# EAGLE design acs712_breaker (EAGLE 5.11)
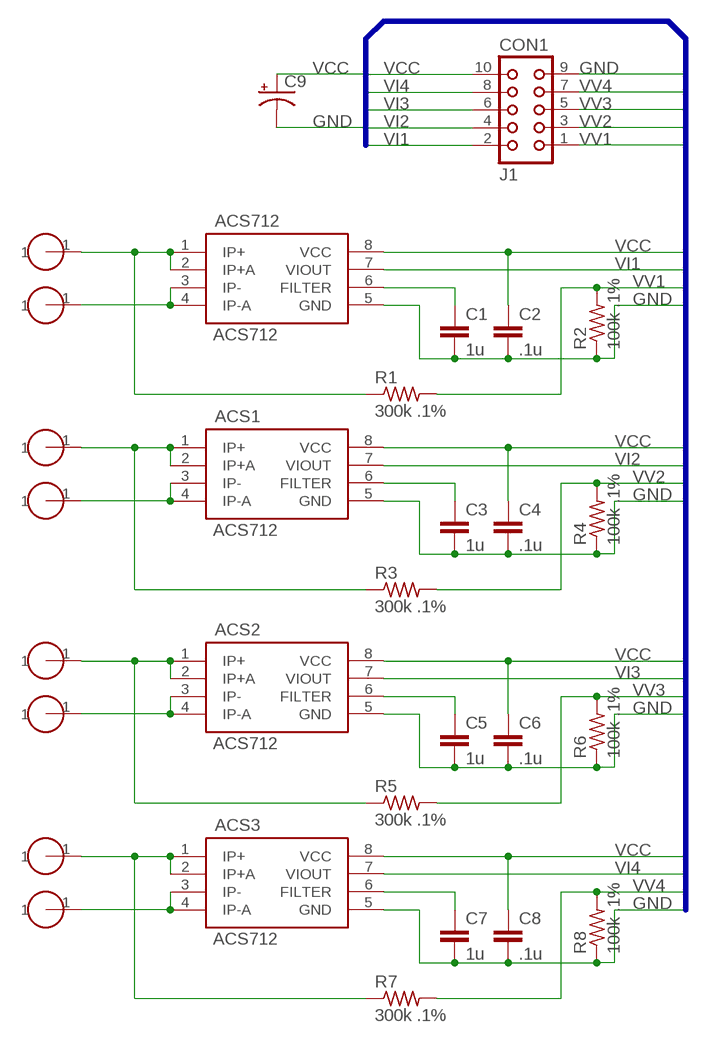
[diagram p0: schematic, sheet 1]

## Parts
ACS1  ACS712  [SOICC]
ACS2  ACS712  [SOICC]
ACS3  ACS712  [SOICC]
ACS712  ACS712  [SOICC]
C1  1u  C-EUC0603  [C0603]
C2  .1u  C-EUC0603  [C0603]
C3  1u  C-EUC0603  [C0603]
C4  .1u  C-EUC0603  [C0603]
C5  1u  C-EUC0603  [C0603]
C6  .1u  C-EUC0603  [C0603]
C7  1u  C-EUC0603  [C0603]
C8  .1u  C-EUC0603  [C0603]
C9  CPOL-USE2.5-6  [E2,5-6]
CON1  J1  CON10  [CON10]
R1  300k .1%  R-US_R0603  [R0603]
R2  100k .1%  R-US_R0603  [R0603]
R3  300k .1%  R-US_R0603  [R0603]
R4  100k .1%  R-US_R0603  [R0603]
R5  300k .1%  R-US_R0603  [R0603]
R6  100k .1%  R-US_R0603  [R0603]
R7  300k .1%  R-US_R0603  [R0603]
R8  100k .1%  R-US_R0603  [R0603]
U$1  LEE_SCREW8  [LEE_SCREW8]
U$2  LEE_SCREW8  [LEE_SCREW8]
U$3  LEE_SCREW8  [LEE_SCREW8]
U$4  LEE_SCREW8  [LEE_SCREW8]
U$5  LEE_SCREW8  [LEE_SCREW8]
U$6  LEE_SCREW8  [LEE_SCREW8]
U$7  LEE_SCREW8  [LEE_SCREW8]
U$8  LEE_SCREW8  [LEE_SCREW8]

## Nets
GND: ACS1.5(GND) ACS2.5(GND) ACS3.5(GND) ACS712.5(GND) C1.2 C2.2 C3.2 C4.2 C5.2 C6.2 C7.2 C8.2 C9.- CON1.9 R2.1 R4.1 R6.1 R8.1
IP+: ACS712.1(IP+) ACS712.2(IP+A) R1.1 U$2.1
IP+1: ACS1.1(IP+) ACS1.2(IP+A) R3.1 U$1.1
IP+2: ACS2.1(IP+) ACS2.2(IP+A) R5.1 U$5.1
IP+3: ACS3.1(IP+) ACS3.2(IP+A) R7.1 U$7.1
IP-: ACS712.3(IP-) ACS712.4(IP-A) U$3.1
IP-1: ACS1.3(IP-) ACS1.4(IP-A) U$4.1
IP-2: ACS2.3(IP-) ACS2.4(IP-A) U$6.1
IP-3: ACS3.3(IP-) ACS3.4(IP-A) U$8.1
N$1: ACS1.6(FILTER) C3.1
N$2: ACS2.6(FILTER) C5.1
N$3: ACS3.6(FILTER) C7.1
N$6: ACS712.6(FILTER) C1.1
VCC: ACS1.8(VCC) ACS2.8(VCC) ACS3.8(VCC) ACS712.8(VCC) C2.1 C4.1 C6.1 C8.1 C9.+ CON1.10
VI1: ACS712.7(VIOUT) CON1.2
VI2: ACS1.7(VIOUT) CON1.4
VI3: ACS2.7(VIOUT) CON1.6
VI4: ACS3.7(VIOUT) CON1.8
VV1: CON1.1 R1.2 R2.2
VV2: CON1.3 R3.2 R4.2
VV3: CON1.5 R5.2 R6.2
VV4: CON1.7 R7.2 R8.2

## Buses
VCC,GND,VI[1..4],VV[1..4]

## Library data of the parts
ACS1-ACS3 ACS712 = lee:ACS712
C1-C8 = resistor:C-EU: CAPACITOR, European symbol
C9 = rcl:CPOL-US: POLARIZED CAPACITOR, American symbol
CON1 = con-harting:CON10: CONNECTOR; OC_FARNELL: unknown; OC_NEWARK: unknown
R1-R8 = resistor:R-US_: RESISTOR, American symbol
U$1-U$8 = acs712_breaker:LEE_SCREW

## Board
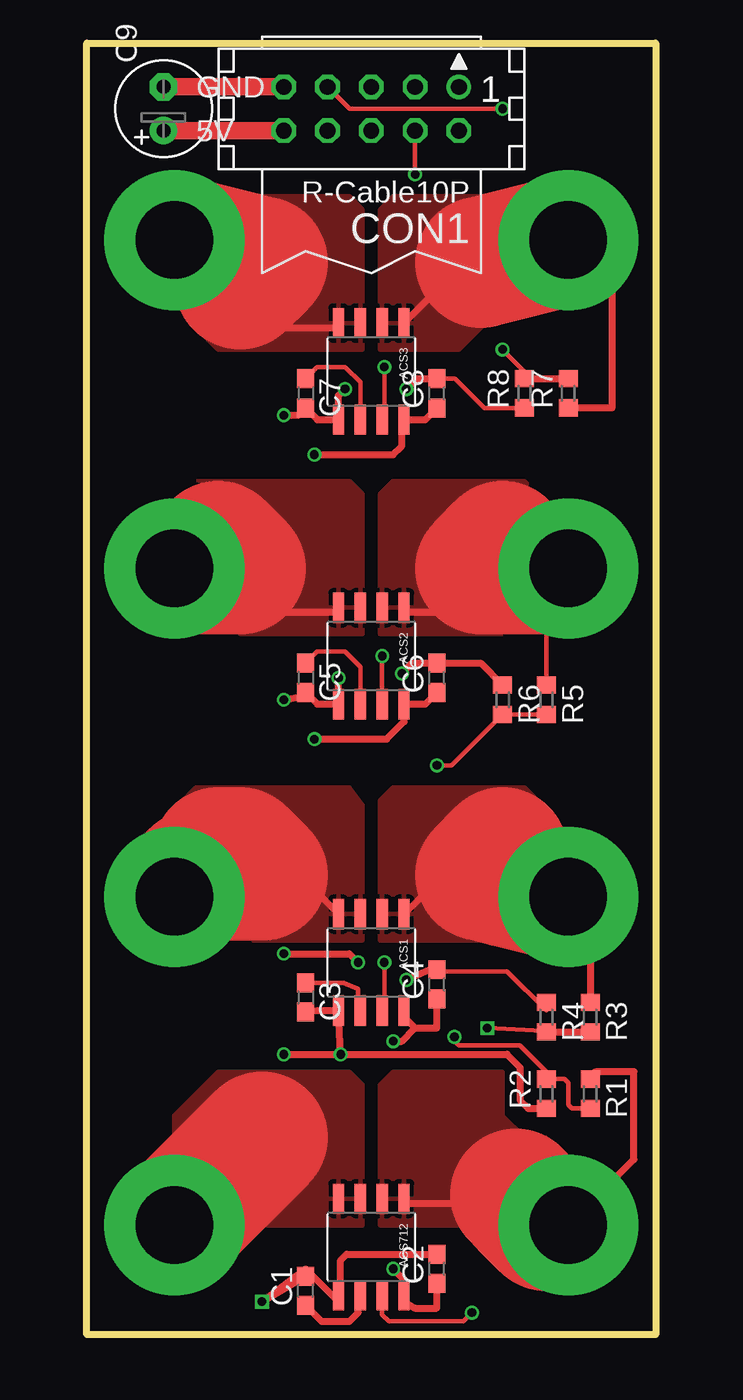
[diagram p1: board, top side]
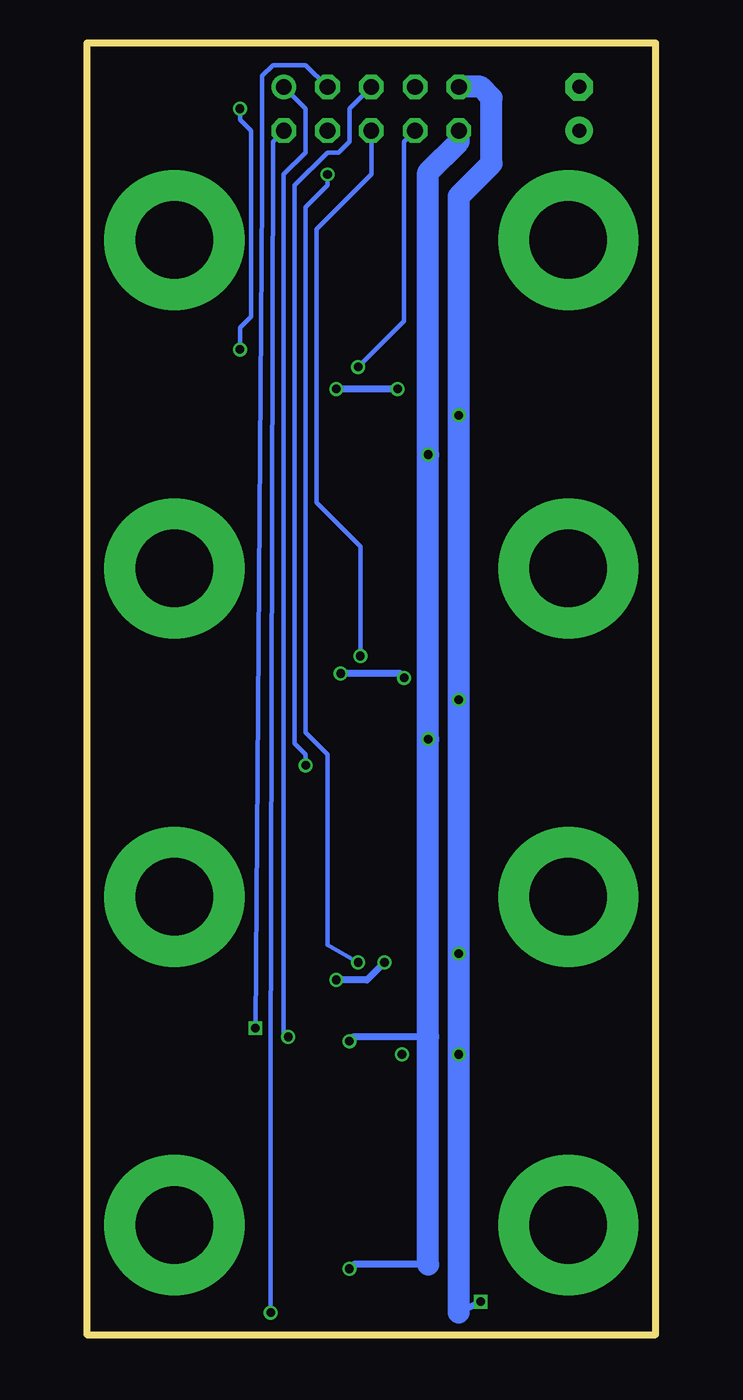
[diagram p2: board, bottom side, seen from below]

Size 33.02 x 74.93 mm. Coordinates in mm from the lower left corner, seen from the top.
Outline: 0,0 0,74.93 33.02,74.93 33.02,0 0,0
Copper layers (1*16): Top 0.035mm / dielectric 1.5mm / Bottom 0.035mm
Design rules "Fusion_eagle_rule_v1.1": minimum track width 6mil, minimum drill 12mil, track to track 6mil, track to pad 6mil, pad to pad 6mil, via to via 6mil, smd to smd 0mil, copper to edge 10mil, drill to drill 10mil, minimum pad ring 10mil, minimum via ring 6mil, stop-mask expansion 2mil, vias tented up to drill 100mil, thermal gap 10mil
tRestrict: area 31.8,0 to 33,74.9; area 0,0 to 1.3,74.9; area 0.4,58.8 to 9.7,68.2; area 0.6,39.9 to 9.6,49; area 23.4,59 to 32.5,68; area 23.3,39.8 to 32.6,49.1; area 0.6,20.9 to 9.6,29.9; area 23.4,20.8 to 32.5,30; area 23.4,1.8 to 32.5,10.9; area 0.5,1.8 to 9.7,10.9
bRestrict: area 0,0 to 1.3,74.9; area 31.8,0 to 33,74.9; area 0.4,1.7 to 9.7,11; area 23.4,1.8 to 32.5,10.9; area 23.3,20.7 to 32.6,30.1; area 0.5,20.8 to 9.7,30; area 0.6,40 to 9.6,48.9; area 23.1,39.6 to 32.8,49.3; area 23.4,59 to 32.5,68; area 0.3,58.7 to 9.9,68.3

### Footprints (pad centres in the part's own frame; a part is rotated, then mirrored left to right if it is on the bottom)
SOICC = smd 1.75 x 0.65: 1 -2.8,1.9; 2 -2.8,0.63; 3 -2.8,-0.64; 4 -2.8,-1.91; 5 2.8,-1.91; 6 2.8,-0.64; 7 2.8,0.63; 8 2.8,1.9
C0603 = smd 1.1 x 1: 1 -0.85,0; 2 0.85,0
E2,5-6 = drill 0.813 pad 1.6 round: + -1.27,0 | drill 0.813 pad 1.6 octagon: - 1.27,0
CON10 = drill 0.914 round: 1 -5.08,-1.27 | drill 0.914 octagon: 2 -5.08,1.27; 3 -2.54,-1.27; 4 -2.54,1.27; 5 0,-1.27; 6 0,1.27; 7 2.54,-1.27; 8 2.54,1.27; 9 5.08,-1.27; 10 5.08,1.27
R0603 = smd 1 x 1.1: 1 -0.85,0; 2 0.85,0
LEE_SCREW8@1 = drill 4.496 pad 8.128 round: 1 0,0

### Placement (x,y rotation side)
ACS1  16.51,21.59 270 top
ACS2  16.51,39.37 270 top
ACS3  16.51,55.88 270 top
ACS712  16.51,5.08 270 top
C1  12.7,2.54 90 top
C2  20.32,3.81 90 top
C3  12.7,19.56 270 top
C4  20.32,20.32 90 top
C5  12.7,38.1 270 top
C6  20.32,38.1 90 top
C7  12.7,54.61 270 top
C8  20.32,54.61 90 top
C9  4.45,71.12 90 top
CON1  16.51,71.12 180 top
R1  29.21,13.97 270 top
R2  26.67,13.97 90 top
R3  29.21,18.41 270 top
R4  26.67,18.41 270 top
R5  26.67,36.83 270 top
R6  24.13,36.83 270 top
R7  27.94,54.61 90 top
R8  25.4,54.61 90 top
U$1  LEE_SCREW8  [LEE_SCREW8@1]  27.94,25.4 0 top
U$2  LEE_SCREW8  [LEE_SCREW8@1]  27.94,6.35 0 top
U$3  LEE_SCREW8  [LEE_SCREW8@1]  5.08,6.35 0 top
U$4  LEE_SCREW8  [LEE_SCREW8@1]  5.08,25.4 0 top
U$5  LEE_SCREW8  [LEE_SCREW8@1]  27.94,44.45 0 top
U$6  LEE_SCREW8  [LEE_SCREW8@1]  5.08,44.45 0 top
U$7  LEE_SCREW8  [LEE_SCREW8@1]  27.94,63.5 0 top
U$8  LEE_SCREW8  [LEE_SCREW8@1]  5.08,63.5 0 top

### Tracks (layer width: path | path; a pad name or v marks a point on that pad's centre or on a via)
GND  (via drill 0.5, 0.5 pad 0.13)
  Top 0.254: 19.9,21.17 C4.2 20.41,21.08 24.38,21.08 26.67,18.8 R4.1 | ACS2.5 | 12.7,37.08 C5.2 | C8.2 21.38,55.46 23.07,53.76 R8.1 | 12.28,53.34 C7.2
  Top 0.406: C3.2 13.38,18.79 ACS1.5 v14.73,16.26 | C2.2 15.07,4.66 14.73,4.32 14.73,2.41 ACS712.5 14.6,1.9 12.7,3.81 v10.16,1.91 C1.2 | v11.43,16.26 v14.73,16.26 | v18.54,20.57 19.9,21.17 | v15.75,21.59 15.24,22.1 v11.43,22.1 | R6.1 22.86,38.95 C6.2 18.88,38.95 v18.29,38.35 | ACS2.5 13.38,36.57 C5.2 | ACS2.5 v14.61,38.1 | v11.43,36.83 12.7,37.08 | C8.2 19.14,55.46 v18.54,54.86 | v14.99,54.86 14.6,54.48 ACS3.5 13.38,53.08 C7.2 | v11.43,53.34 12.28,53.34 | R2.1 25.61,13.12 25.15,13.59 25.15,15.49 24.38,16.26 v14.73,16.26
  Top 1.016: CON1.9 C9.-
  Bottom 0.254: v14.61,38.1 14.86,38.35
  Bottom 0.406: v10.16,1.91 11.43,1.27 | v18.54,20.57 16.76,20.57 v15.75,21.59 | 14.86,38.35 v18.29,38.35 | v14.99,54.86 v18.54,54.86
  Bottom 1.27: 11.43,1.27 v11.43,16.26 v11.43,22.1 v11.43,36.83 v11.43,53.34 11.43,66.04 9.53,67.94 9.53,71.75 10.16,72.39 CON1.9
IP+
  Top 0.406: 24.89,8.13 25.65,8.89 30.48,8.89 31.75,10.16 31.75,15.24 29.63,15.24 arc90 R1.1 | ACS712.1 18.67,7.62 25.4,7.62
  Top 7.62: U$2.1 26.67,6.35 25.4,7.62 24.89,8.13
  pour Top: 27.94,6.35 17.02,6.35 17.02,14.48 17.78,15.24 24.13,15.24 24.13,12.7 25.4,11.43 26.67,11.43 27.94,10.16
IP+1
  Top 0.406: R3.1 29.21,24.13 27.94,24.13 U$1.1 | ACS1.1 19.42,25.4 24.13,25.4 24.35,25.62 24.35,26.3
  Top 7.62: U$1.1 24.35,26.3 22.86,26.67 24.13,27.94
  pour Top: 27.94,25.4 25.4,22.86 17.02,22.86 17.02,30.99 17.78,31.75 25.4,31.75 27.94,29.21
IP+2
  Top 0.254: R5.1 26.67,43.18 U$5.1
  Top 0.406: ACS2.1 18.67,41.91 20.32,41.91 22.86,44.45
  Top 7.62: U$5.1 22.86,44.45 24.13,45.72
  pour Top: 27.94,44.45 24.13,40.64 17.02,40.64 17.02,48.77 17.78,49.53 25.4,49.53 27.94,46.99
IP+3
  Top 0.406: U$7.1 30.48,60.96 30.48,53.76 R7.1 | ACS3.1 21.96,62.23 22.86,62.23
  Top 7.62: 22.86,62.23 U$7.1
  pour Top: 27.94,63.5 21.59,57.15 17.02,57.15 17.02,65.28 17.78,66.04 26.67,66.04
IP-
  Top 7.62: U$3.1 10.16,11.43
  pour Top: 5.08,6.35 16,6.35 16,14.48 15.24,15.24 7.62,15.24 5.08,12.7
IP-1
  Top 0.406: ACS1.4 12.32,26.67 10.16,26.67
  Top 7.62: U$4.1 6.35,26.67 10.16,26.67 8.89,27.94 7.62,27.94
  pour Top: 5.08,25.4 7.62,22.86 16,22.86 16,30.73 15.24,31.75 6.35,31.75 5.08,30.48
IP-2
  Top 0.406: ACS2.4 14.34,41.91 10.16,41.91 8.89,43.18 8.89,44.45
  Top 7.62: U$6.1 8.89,44.45 7.62,45.72
  pour Top: 5.08,44.45 8.89,40.64 16,40.64 16,48.77 15.24,49.53 6.35,49.53 5.08,48.26
IP-3
  Top 0.406: ACS3.4 14.34,58.42 11.43,58.42 8.89,60.96
  Top 7.62: U$8.1 10.16,62.23 8.89,60.96
  pour Top: 5.08,63.5 5.08,59.69 7.62,57.15 16,57.15 16,65.28 15.24,66.04 6.35,66.04 6.35,64.77
N$1
  Top 0.254: C3.1 14.9,20.41 15.75,20.07 15.75,18.91
  Top 0.406: 15.75,18.91 ACS1.6
N$2
  Top 0.254: C5.1 13.37,39.62 14.99,39.62 15.87,38.74 ACS2.6
N$3
  Top 0.254: C7.1 13.37,56.13 14.99,56.13 15.87,55.25 ACS3.6
N$6
  Top 0.254: 15.75,2.16 ACS712.6
  Top 0.406: C1.1 13.63,0.76 15.24,0.76 15.75,1.27 15.75,2.16
VCC  (via drill 0.5 pad 0.13)
  Top 0.254: 18.29,52.96 ACS3.8 | ACS2.8
  Top 0.406: C4.1 20.32,17.78 19.05,17.78 | 19.05,17.78 18.41,18.42 ACS1.8 | C2.1 20.32,1.52 19.05,1.52 18.41,1.91 ACS712.8 18.41,3.18 v17.78,3.81 | 19.05,17.78 18.29,17.02 v17.78,17.02 | C8.1 19.64,53.08 ACS3.8 | v13.21,51.05 17.78,51.05 18.29,51.56 18.29,52.96 | v13.21,34.54 17.4,34.54 18.41,35.56 ACS2.8 | ACS2.8 19.64,36.57 C6.1
  Top 1.016: C9.+ CON1.10
  Bottom 0.406: 13.21,4.06 17.53,4.06 v17.78,3.81 | v17.78,17.02 17.53,17.27 13.21,17.27
  Bottom 1.27: 13.21,4.06 13.21,17.27 v13.21,34.54 v13.21,51.05 13.21,67.44 11.43,69.22 CON1.10
VI1  (via drill 0.5 pad 0.13)
  Top 0.254: ACS712.7 17.14,1.15 17.53,0.76 21.84,0.76 v22.35,1.27
  Bottom 0.254: v22.35,1.27 22.35,14.48 22.23,69.22 CON1.2
VI2  (via drill 0.5 pad 0.13)
  Top 0.254: ACS1.7 17.27,18.92 v17.27,21.59 | v19.05,67.31 CON1.4
  Bottom 0.254: v17.27,21.59 19.05,22.61 19.05,33.66 20.32,34.92 20.32,65.41 19.05,66.67 v19.05,67.31
VI3  (via drill 0.5 pad 0.13)
  Top 0.254: ACS2.7 v17.14,39.37
  Bottom 0.254: v17.14,39.37 17.14,45.72 19.68,48.26 19.68,64.14 16.51,67.31 CON1.6
VI4  (via drill 0.5 pad 0.13)
  Top 0.254: ACS3.7 17.27,53.21 v17.27,56.13
  Bottom 0.254: v17.27,56.13 14.61,58.8 14.61,69.22 CON1.8
VV1  (via drill 0.5 pad 0.13)
  Top 0.254: R1.2 28.16,13.12 27.94,13.34 27.94,14.61 27.73,14.82 R2.2 26.67,15.24 25.15,16.76 21.59,16.76 21.34,17.02 v21.34,17.27
  Bottom 0.254: v21.34,17.27 21.59,17.53 21.59,67.31 20.32,68.58 20.32,71.12 CON1.1
VV2  (via drill 0.5 pad 0.13)
  Top 0.254: R4.2 26.5,17.61 v23.24,17.78
  Top 0.406: R4.2 R3.2
  Bottom 0.254: v23.24,17.78 22.86,66.04 22.86,73.03 22.23,73.66 20.32,73.66 CON1.3
VV3  (via drill 0.5 pad 0.13)
  Top 0.254: R5.2 R6.2 21.17,33.02 v20.32,33.02
  Bottom 0.254: v20.32,33.02 20.32,33.66 20.95,34.29 20.95,66.67 19.05,68.58 18.41,68.58 17.78,69.22 17.78,71.12 CON1.5
VV4  (via drill 0.5 pad 0.13)
  Top 0.254: R8.2 25.4,55.88 v24.13,57.15 | v24.13,71.12 15.24,71.12 CON1.7
  Top 0.406: R8.2 R7.2
  Bottom 0.254: v24.13,57.15 24.13,58.42 23.5,59.05 23.5,69.85 24.13,70.48 v24.13,71.12

### Text on the board
tNames: GND | 5V
bDocu: LEE MAGNUSSON | ACS 712 BOARD | REV 2 | 2/13/11